# EAGLE design LampenSteuerung (EAGLE 7.0.0)
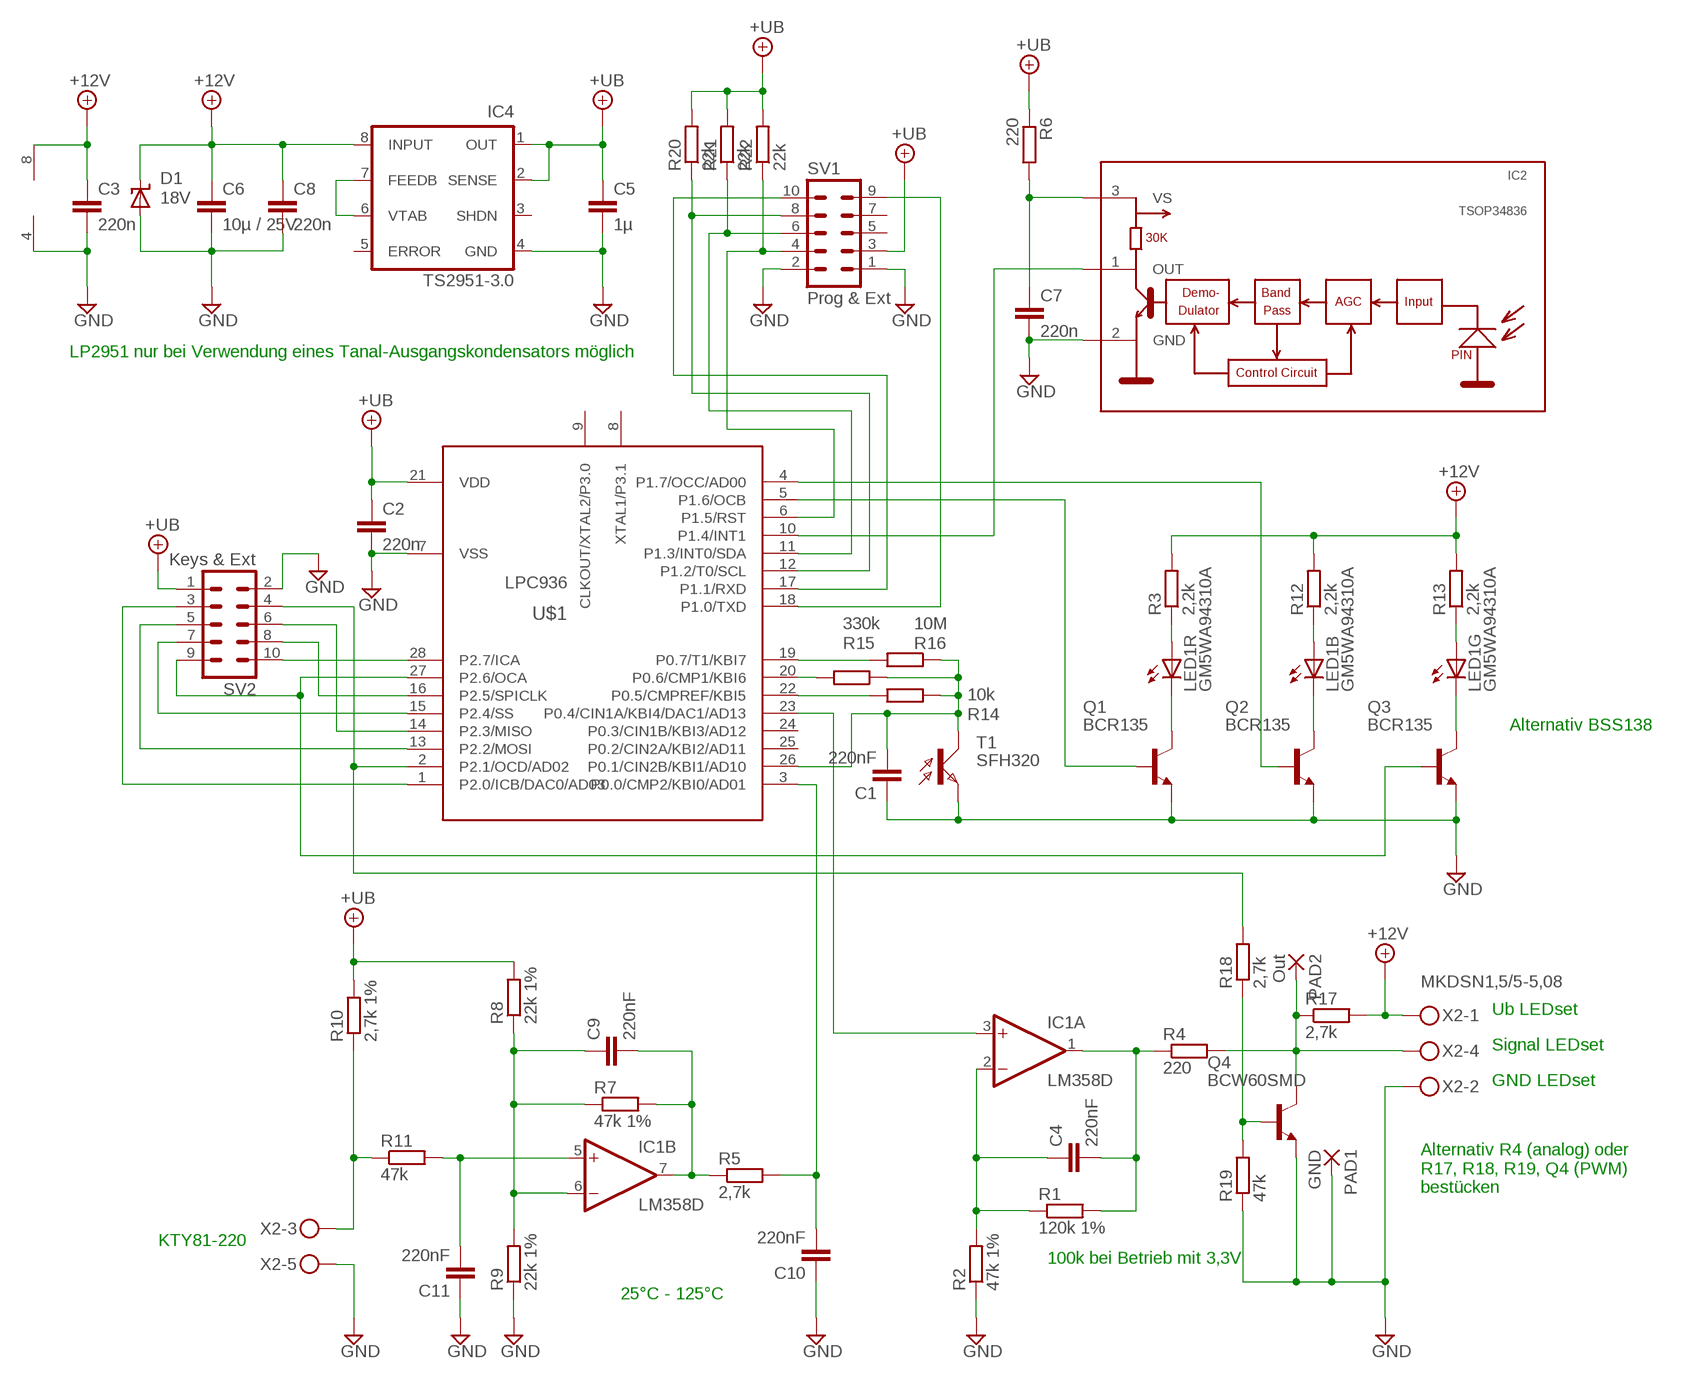
[diagram p0: schematic, sheet 1]

## Parts
C1  220nF  C-EUC0603  [C0603]
C2  220n  C-EUC0603  [C0603]
C3  220n  C-EUC0603  [C0603]
C4  220nF  C-EUC0603  [C0603]
C5  1µ  C-EUC0805  [C0805]
C6  10µ / 25V  C-EUC1206  [C1206]
C7  220n  C-EUC0603  [C0603]
C8  220n  C-EUC0603  [C0603]
C9  220nF  C-EUC0603  [C0603]
C10  220nF  C-EUC0603  [C0603]
C11  220nF  C-EUC0603  [C0603]
D1  18V  SUPPRESSOR-SMBJ  [SMBJ]
IC1  LM358D  [SO08]
IC2  TSOP34836  [TSOP348]
IC4  TS2951-3.0  LP2951CM-3.0  [SO-08]
LED1  GM5WA94310A  [GM5WA94310A]
PAD1  GND  1,6/0,8  [1,6/0,8]
PAD2  Out  1,6/0,8  [1,6/0,8]
Q1  BCR135  BCW60SMD  [SOT23-BEC]
Q2  BCR135  BCW60SMD  [SOT23-BEC]
Q3  BCR135  BCW60SMD  [SOT23-BEC]
Q4  BCW60SMD  [SOT23-BEC]
R1  120k 1%  R-EU_R0805  [R0805]
R2  47k 1%  R-EU_R0805  [R0805]
R3  2,2k  R-EU_R0805  [R0805]
R4  220  R-EU_R0805  [R0805]
R5  2,7k  R-EU_R0805  [R0805]
R6  220  R-EU_R0805  [R0805]
R7  47k 1%  R-EU_R0805  [R0805]
R8  22k 1%  R-EU_R0805  [R0805]
R9  22k 1%  R-EU_R0805  [R0805]
R10  2,7k 1%  R-EU_R0805  [R0805]
R11  47k  R-EU_R0805  [R0805]
R12  2,2k  R-EU_R0805  [R0805]
R13  2,2k  R-EU_R0805  [R0805]
R14  10k  R-EU_R0805  [R0805]
R15  330k  R-EU_R0805  [R0805]
R16  10M  R-EU_R0805  [R0805]
R17  2,7k  R-EU_R0805  [R0805]
R18  2,7k  R-EU_R0805  [R0805]
R19  47k  R-EU_R0805  [R0805]
R20  22k  R-EU_R0805  [R0805]
R21  22k  R-EU_R0805  [R0805]
R22  22k  R-EU_R0805  [R0805]
SV1  Prog & Ext  MA05-2  [MA05-2]
SV2  Keys & Ext  MA05-2  [MA05-2]
T1  SFH320  [PLCC2]
U$1  LPC936  [TSSOP28]
X2  MKDSN1,5/5-5,08  [MKDSN1,5/5-5,08]

## Nets
+12V: C3.1 C6.1 C8.1 D1.C IC1.8(P:V+) IC4.8(INPUT) R3.2 R12.2 R13.2 R17.2 X2.1
+UB: C2.1 C5.1 IC4.1(OUT) IC4.2(SENSE) R6.1 R8.2 R10.2 R20.2 R21.2 R22.2 SV1.3 SV2.1 U$1.21(VDD)
GND: C1.1 C2.2 C3.2 C5.2 C6.2 C7.2 C8.2 C10.1 C11.1 D1.A IC1.4(P:V-) IC2.2(GND) IC4.4(GND) PAD1.1(P) Q1.E Q2.E Q3.E Q4.E R2.1 R9.1 R19.1 SV1.1 SV1.2 SV2.2 T1.C(E) U$1.7(VSS) X2.2 X2.5
N$1: IC4.6(VTAB) IC4.7(FEEDB)
N$2: IC2.1(OUT) U$1.10(P1.4/INT1)
N$3: IC1.3(A:+IN) U$1.23(P0.4/CIN1A/KBI4/DAC1/AD13)
N$4: C9.1 IC1.6(B:-IN) R7.1 R8.1 R9.2
N$5: LED1.5(R:C) Q1.C
N$6: C4.2 IC1.1(A:OUT) R1.2 R4.1
N$7: C4.1 IC1.2(A:-IN) R1.1 R2.2
N$8: SV1.10 U$1.17(P1.1/RXD)
N$9: PAD2.1(P) Q4.C R4.2 R17.1 X2.4
N$10: C7.1 IC2.3(VS) R6.2
N$11: SV1.9 U$1.18(P1.0/TXD)
N$12: LED1.6(B:C) Q2.C
N$13: R22.1 SV1.4 U$1.6(P1.5/RST)
N$14: LED1.1(B:A) R12.1
N$15: R20.1 SV1.8 U$1.12(P1.2/T0/SCL)
N$16: R21.1 SV1.6 U$1.11(P1.3/INT0/SDA)
N$17: C10.2 R5.2 U$1.3(P0.0/CMP2/KBI0/AD01)
N$18: R10.1 R11.1 X2.3
N$19: C9.2 IC1.7(B:OUT) R5.1 R7.2
N$20: C11.2 IC1.5(B:+IN) R11.2
N$22: LED1.2(R:A) R3.1
N$23: SV2.3 U$1.1(P2.0/ICB/DAC0/AD03)
N$24: R18.2 SV2.4 U$1.2(P2.1/OCD/AD02)
N$25: SV2.5 U$1.13(P2.2/MOSI)
N$26: SV2.6 U$1.14(P2.3/MISO)
N$27: SV2.7 U$1.15(P2.4/SS)
N$28: SV2.8 U$1.16(P2.5/SPICLK)
N$29: Q3.B SV2.9 U$1.27(P2.6/OCA)
N$30: SV2.10 U$1.28(P2.7/ICA)
N$31: LED1.3(G:A) R13.1
N$32: LED1.4(G:C) Q3.C
N$33: Q1.B U$1.5(P1.6/OCB)
N$34: Q2.B U$1.4(P1.7/OCC/AD00)
N$36: C1.2 R14.1 R15.1 R16.1 T1.A(C) U$1.26(P0.1/CIN2B/KBI1/AD10)
N$37: R16.2 U$1.19(P0.7/T1/KBI7)
N$38: R15.2 U$1.20(P0.6/CMP1/KBI6)
N$39: R14.2 U$1.22(P0.5/CMPREF/KBI5)
N$40: Q4.B R18.1 R19.2
Unconnected: IC4.3(SHDN) IC4.5(ERROR) SV1.5 SV1.7 U$1.8(XTAL1/P3.1) U$1.9(CLKOUT/XTAL2/P3.0) U$1.24(P0.3/CIN1B/KBI3/AD12) U$1.25(P0.2/CIN2A/KBI2/AD11)

## Notes on the sheet
- LP2951 nur bei Verwendung eines Tanal-Ausgangskondensators möglich
- Alternativ BSS138
- Ub LEDset
- Signal LEDset
- GND LEDset
- Alternativ R4 (analog) oder
  R17, R18, R19, Q4 (PWM)
  bestücken
- KTY81-220
- 100k bei Betrieb mit 3,3V
- 25°C - 125°C

## Library data of the parts
C1-C11 = rcl:C-EU: CAPACITOR, European symbol
D1 = diode:SUPPRESSOR-: Suppressor diode
IC1 = linear:LM358: OP AMP also LM158; LM258; LM2904 Source: http://cache.national.com/ds/LM/LM158.pdf
IC2 = vishay-1:TSOP348*: IR Receiver Modules for Remote Control Systems http://www.vishay.com/ir-receiver-modules/
IC4 = v-reg:LP2951?*: Series of Adjustable Micropower Voltage Regulators Source: http://cache.national.com/ds/LP/LP2950.pdf
LED1 = led:GM5WA94310A: Chip LED RGB Source: http://document.sharpsma.com/files/GM5WA94310A_SS.pdf
PAD1 PAD2 = wirepad:1,6/0,8: THROUGH-HOLE PAD
Q1-Q4 = transistor-npn:BCW60*: NPN Transistor
R1-R22 = rcl:R-EU_: RESISTOR, European symbol
SV1 SV2 = con-lstb:MA05-2: PIN HEADER; OC_FARNELL: unknown; OC_NEWARK: unknown
T1 = opto2:SFH320: PHOTO TRANSISTOR
U$1 = nxp:LPC936
X2 = con-phoenix-508:MKDSN1,5/5-5,08: MKDSN 1,5/ 5-5,08 Printklemme Nennstrom: 13,5 A Nennspannung: 250 V Rastermaß: 5,08 mm Polzahl: 5 Anschlussart: Schraubanschluss Montage: Löten Anschlussrichtung Leiter/Platine: 0 ° Artikelnummer: 1729157 Source: http://eshop.phoenixcontact.com .. 1729157.pdf; MPN: SMKDSN1,5/5-5,08; OC_FARNELL: 1792906; OC_NEWARK: 70R0301

## Board
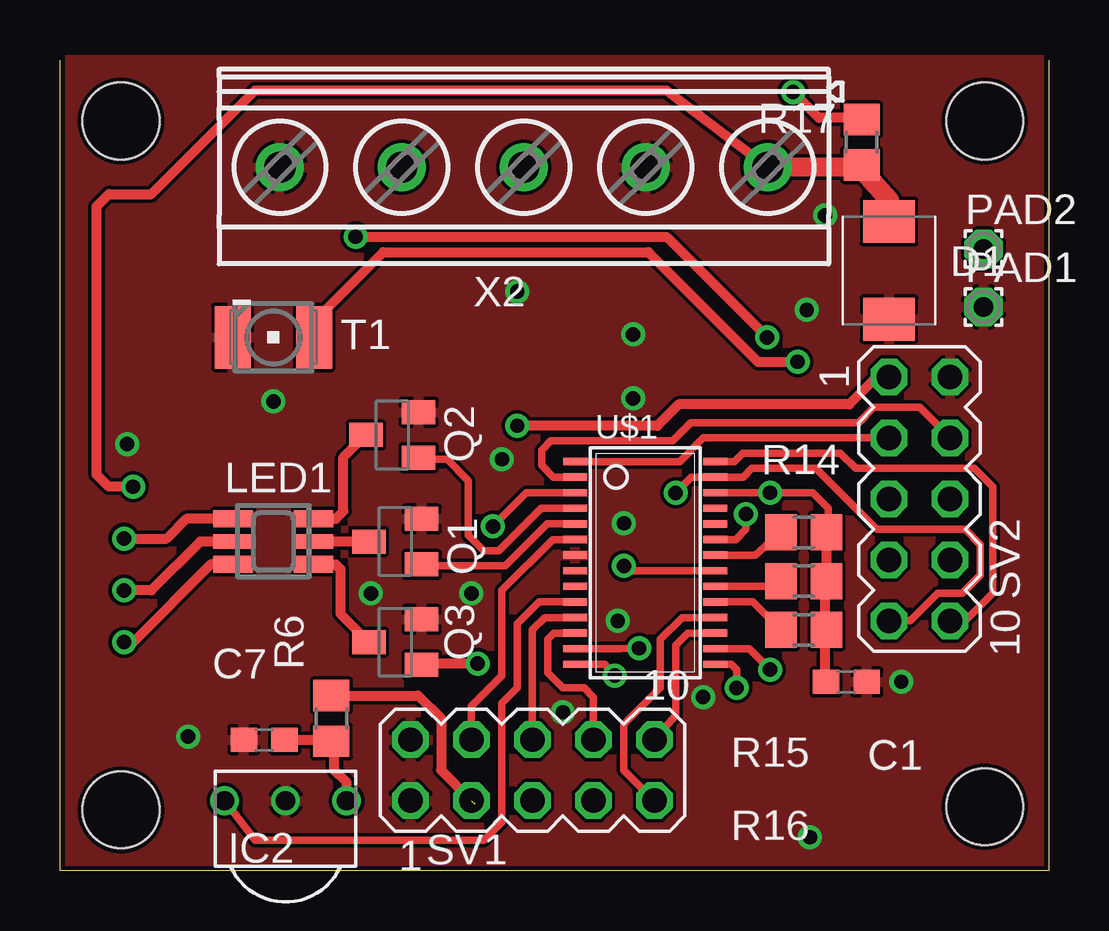
[diagram p1: board, top side]
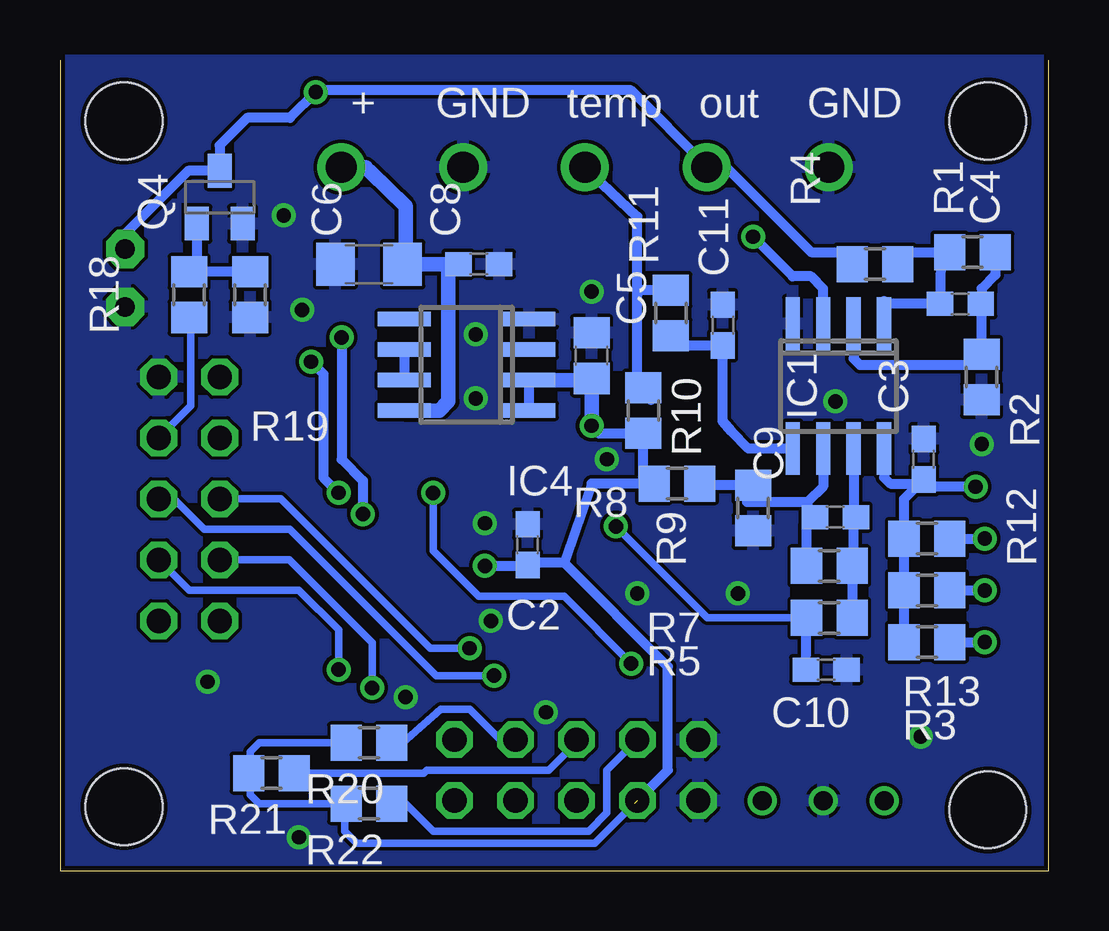
[diagram p2: board, bottom side, seen from below]

Size 41.2 x 33.78 mm. Coordinates in mm from the lower left corner, seen from the top.
Outline: 0,33.78 0,0 41.2,0 41.2,33.78
Copper layers (1*16): Top 0.035mm / dielectric 1.5mm / Bottom 0.035mm
Design rules "platinensammler_02": minimum track width 0.15mm, minimum drill 0.3mm, track to track 0.15mm, track to pad 0.15mm, pad to pad 0.15mm, via to via 0.15mm, smd to smd 0mil, copper to edge 0.2mm, drill to drill 0.2mm, minimum pad ring 0.2mm, minimum via ring 0.2mm, stop-mask expansion 4mil, vias tented up to drill 0.8mm, thermal gap 0.15mm
Holes 3.2 mm at 38.53,2.67 2.54,2.54 2.54,31.24 38.53,31.24

### Footprints (pad centres in the part's own frame; a part is rotated, then mirrored left to right if it is on the bottom)
C0603 = smd 1.1 x 1: 1 -0.85,0; 2 0.85,0
C0805 = smd 1.3 x 1.5: 1 -0.95,0; 2 0.95,0
C1206 = smd 1.6 x 1.8: 1 -1.4,0; 2 1.4,0
SMBJ = smd 1.78 x 2.16: A 2.04,0; C -2.03,0
SO08 = smd 0.6 x 2.2: 1 -1.905,-2.6; 2 -0.635,-2.6; 3 0.635,-2.6; 4 1.905,-2.6; 5 1.905,2.6; 6 0.635,2.6; 7 -0.635,2.6; 8 -1.905,2.6
TSOP348 = drill 0.8: 1 -2.54,0; 2 0,0; 3 2.54,0
SO-08 = smd 0.6 x 2.2: 1 -1.905,-2.6; 2 -0.635,-2.6; 3 0.635,-2.6; 4 1.905,-2.6; 5 1.905,2.6; 6 0.635,2.6; 7 -0.635,2.6; 8 -1.905,2.6
GM5WA94310A = smd 0.7 x 1.65: 1 -0.95,-1.675; 3 0.95,-1.675; 4 0.95,1.675; 6 -0.95,1.675 | smd 0.6 x 1.65: 2 0,-1.675; 5 0,1.675
1,6/0,8 = drill 0.813 pad 1.6 octagon: 1 0,0
SOT23-BEC = smd 1 x 1.4: B -0.95,-1.1; C 0,1.1; E 0.95,-1.1
R0805 = smd 1.3 x 1.5: 1 -0.95,0; 2 0.95,0
MA05-2 = drill 1.016 octagon: 1 -5.08,-1.27; 2 -5.08,1.27; 3 -2.54,-1.27; 4 -2.54,1.27; 5 0,-1.27; 6 0,1.27; 7 2.54,-1.27; 8 2.54,1.27; 9 5.08,-1.27; 10 5.08,1.27
PLCC2 = smd 2.6 x 1.5: A 0,1.7; C 0,-1.7
TSSOP28 = smd 0.305 x 0.991: 1 -4.225,-2.918; 2 -3.575,-2.918; 3 -2.925,-2.918; 4 -2.275,-2.918; 5 -1.625,-2.918; 6 -0.975,-2.918; 7 -0.325,-2.918; 8 0.325,-2.918; 9 0.975,-2.918; 10 1.625,-2.918; 11 2.275,-2.918; 12 2.925,-2.918; 13 3.575,-2.918; 14 4.225,-2.918; 15 4.225,2.918; 16 3.575,2.918; 17 2.925,2.918; 18 2.275,2.918; 19 1.625,2.918; 20 0.975,2.918; 21 0.325,2.918; 22 -0.325,2.918; 23 -0.975,2.918; 24 -1.625,2.918; 25 -2.275,2.918; 26 -2.925,2.918; 27 -3.575,2.918; 28 -4.225,2.918
MKDSN1,5/5-5,08 = drill 1.3 pad 2: 1 -10.181,0.025; 2 -5.101,0.025; 3 -0.021,0.025; 4 5.059,0.025; 5 10.139,0.025

### Placement (x,y rotation side)
C1  32.77,7.87 180 top
C2  21.72,13.59 90 bottom
C3  5.21,17.14 90 bottom
C4  3.68,23.62 180 bottom
C5  19.05,21.46 90 bottom
C6  28.32,25.27 180 bottom
C7  8.51,5.46 180 top
C8  23.75,25.27 0 bottom
C9  8.89,14.73 0 bottom
C10  9.27,8.38 180 bottom
C11  13.59,22.73 270 bottom
D1  34.54,25.02 270 top
IC1  8.76,20.19 180 bottom
IC2  9.4,2.92 0 top
IC4  24.26,21.08 90 bottom
LED1  8.89,13.72 270 top
PAD1  38.48,23.5 0 top
PAD2  38.48,25.91 0 top
Q1  13.97,13.72 90 top
Q2  13.84,18.16 90 top
Q3  13.97,9.53 90 top
Q4  34.54,28.07 0 bottom
R1  3.17,25.78 180 bottom
R2  2.79,20.57 90 bottom
R3  5.08,11.68 180 bottom
R4  7.24,25.27 180 bottom
R5  9.14,10.54 180 bottom
R6  11.3,6.35 270 top
R7  9.14,12.7 0 bottom
R8  15.49,16.13 180 bottom
R9  12.32,15.11 90 bottom
R10  16.89,19.18 270 bottom
R11  15.75,23.24 270 bottom
R12  5.08,13.84 180 bottom
R13  5.08,9.53 180 bottom
R14  30.99,14.1 180 top
R15  30.99,12.06 180 top
R16  30.99,10.03 180 top
R17  33.4,30.35 270 top
R18  35.81,24 270 bottom
R19  33.27,24 90 bottom
R20  28.32,5.33 180 bottom
R21  32.38,4.06 180 bottom
R22  28.32,2.79 180 bottom
SV1  19.68,4.19 0 top
SV2  35.81,15.49 270 top
T1  8.89,22.23 270 top
U$1  24.38,12.83 270 top
X2  19.3,29.34 180 top

### Tracks (layer width: path | path; a pad name or v marks a point on that pad's centre or on a via)
+12V  (via drill 0.6)
  Top 0.406: v3.05,16 2.03,16 1.52,16.51 1.52,27.69 2.03,28.19 3.81,28.19 8.13,32.51 25.27,32.51 X2.1 | R17.2 33.4,29.44 33.3,29.34
  Top 0.813: D1.C 34.54,27.94 33.3,29.34 X2.1
  Bottom 0.305: 28.47,29.31 28.28,29.12
  Bottom 0.406: IC1.8 6.86,16.38 6.6,16.13 4.95,16.13 C3.1 | C8.1 25.02,25.27 | C6.1 26.8,25.27 | R13.2 R3.2 R12.2 6.03,15.5 C3.1 | v3.05,16 4.76,16 C3.1
  Bottom 0.61: IC4.8 25.4,19.18 25.02,19.56 25.02,25.27 C6.1 | 26.8,25.27 26.8,27.69 28.28,29.12 28.37,29.21 | 28.47,29.31 X2.1
+UB  (via drill 0.6)  (1 unrouted)
  Top 0.305: U$1.21 23.69,12.5 v23.5,12.7
  Top 0.406: SV2.1 34.04,20.57 32.89,19.43 25.78,19.43 24.89,18.54 v19.05,18.54 | R6.1 14.93,7.3 15.88,6.35 15.88,4.19 SV1.3
  Bottom 0.305: 21.78,12.7 C2.1 | R20.2 32.89,5.33 33.27,4.95 33.27,4.12 R21.2 33.27,4 33.27,3.17 32.89,2.79 29.34,2.79 | R22.2 29.34,2.79 | 17.27,2.79 18.92,1.14 28.83,1.14 29.34,1.65 29.34,2.79
  Bottom 0.406: IC4.1 IC4.2 | 19.5,20.45 C5.1 | SV1.3 15.88,4.19 15.88,8.51 20.19,12.83 | v23.5,12.7 21.78,12.7 | 20.19,12.83 19.05,16.13 16.89,16.13 | 20.19,12.83 21.66,12.83 C2.1 | R8.2 16.76,15.75 16.89,16.13 | v19.05,18.54 18.73,18.23 R10.2 16.89,16.13
  Bottom 0.61: IC4.2 19.5,20.45 | v19.05,18.54 C5.1
GND  (via drill 0.6)
  other vias: 23.5,14.48 8.89,19.56 19.05,24.13 31.88,27.3 23.88,22.35 23.88,19.68 2.79,17.78 12.95,11.56 35.05,7.87 23.24,10.41 17.14,11.56 31.11,23.37 5.33,5.59 18.41,17.14 31.24,1.4 20.95,6.6 26.8,7.24
  pour Bottom: 41.2,33.78 0,33.78 0,0 41.2,0
  pour Top: 41.2,33.78 0,33.78 0,-0.13 41.2,0
N$1
  Bottom 0.406: IC4.6 IC4.7
N$2
  Top 0.305: U$1.10 19.96,11.2 19.05,10.29 19.05,7.62 18.41,6.99 18.41,2.03 17.65,1.27 8.13,1.27 IC2.1
N$3  (via drill 0.6)
  Top 0.305: U$1.23 28.15,13.8 28.57,14.22 v28.57,14.86
  Top 0.406: v12.32,26.42 25.27,26.42 v29.46,22.23
  Bottom 0.406: IC1.3 9.4,24.26 9.91,24.77 10.67,24.77 v12.32,26.42 | v29.46,22.23 29.46,17.14 28.57,16.26 v28.57,14.86
N$4
  Bottom 0.305: 14.61,16.06 R8.1 | 12.57,15.37 R9.2
  Bottom 0.406: IC1.6 9.4,16 10.03,15.37 | 12.57,15.37 10.03,15.37 | R9.2 14.61,16.06 | R7.1 10.09,14.38 C9.1 9.99,14.82 10.03,15.37
N$5
  Top 0.406: Q1.C LED1.5
N$6
  Bottom 0.406: R4.1 6.29,25.71 6.22,25.78 R1.2 4.51,25.37 C4.2 6.86,23.62 | 6.86,23.75 6.86,23.62 | 6.86,23.62 IC1.1
N$7
  Bottom 0.406: R1.1 2.23,24.83 2.79,24.26 C4.1 2.79,23.81 R2.2 2.86,21.08 7.87,21.08 8.13,21.34 IC1.2
N$8
  Top 0.305: U$1.17 26.17,9.9 25.65,9.4 25.65,6.48 SV1.10
N$9  (via drill 0.6)
  Top 0.406: R17.1 33.21,31.3 33.15,31.37 31.62,31.37 v30.54,32.45
  Bottom 0.406: R4.2 8.19,25.71 8.26,25.78 9.91,25.78 13.36,29.23 14.16,29.23 X2.4 14.24,29.36 17.4,32.51 30.48,32.51 v30.54,32.45 31.62,31.37 33.4,31.37 34.54,30.23 Q4.C 35.86,29.17 38.48,26.54 PAD2.1
N$10
  Top 0.406: IC2.3 11.94,3.68 11.43,4.19 11.43,5.27 R6.2 11.24,5.46 C7.1
N$11
  Top 0.305: SV1.9 23.5,4.19 23.5,6.1 25.02,7.62 25.02,9.65 25.92,10.55 U$1.18
N$12
  Top 0.406: LED1.6 11.49,14.67 11.81,14.99 11.81,17.23 Q2.C
N$13
  Top 0.305: U$1.6 20.53,13.8 18.41,11.68 18.41,8.13 17.14,6.86 SV1.4
  Bottom 0.305: R22.1 26.8,2.79 25.65,1.65 19.18,1.65 18.41,2.41 18.41,4.19 SV1.4
N$14  (via drill 0.6)
  Top 0.406: LED1.1 5.27,14.67 4.45,13.84 v2.67,13.84
  Bottom 0.406: R12.1 v2.67,13.84
N$15
  Top 0.305: U$1.12 20.57,9.9 20.32,9.65 20.32,8.26 20.95,7.62 21.84,7.62 22.23,7.24 SV1.8
  Bottom 0.305: SV1.8 22.86,5.46 24.13,6.73 25.34,6.73 26.92,5.33 R20.1
N$16
  Top 0.305: U$1.11 20.2,10.55 19.68,10.03 SV1.6
  Bottom 0.305: SV1.6 19.68,5.33 20.83,4.19 25.91,4.19 26.04,4.06 R21.1
N$17  (via drill 0.6)
  Top 0.305: v18.03,14.35 19.43,15.75 U$1.3
  Bottom 0.305: R5.2 14.22,10.54 v18.03,14.35
  Bottom 0.406: C10.2 R5.2
N$18
  Bottom 0.406: X2.3 17.14,27.26 17.14,24 | R10.1 16.57,19.62 17.14,20.19 17.14,24 | R11.1 17.08,24.19 17.14,24
N$19
  Bottom 0.406: IC1.7 8.13,14.42 | 8.13,14.42 C9.2 | R5.1 R7.2 8.13,12.7 8.13,14.42
N$20
  Bottom 0.406: IC1.5 12.51,17.59 13.21,18.29 13.59,18.73 C11.2 15.34,21.88 R11.2
N$22  (via drill 0.6)
  Top 0.406: LED1.2 5.84,13.72 3.81,11.68 v2.67,11.68
  Bottom 0.406: R3.1 v2.67,11.68
N$23
  Top 0.305: U$1.1 25.82,17.05 26.8,18.03 SV2.3
N$24
  Top 0.305: U$1.2 20.55,16.4 20.07,16.89 20.07,17.53 20.45,17.91 25.53,17.91 26.29,18.67 33.27,18.67 33.91,19.3 35.81,19.3 SV2.4
  Bottom 0.305: SV2.4 35.75,19.37 35.75,22.99 R18.2
N$25  (via drill 0.6)
  Top 0.305: U$1.13 23.35,9.25 v24.13,9.27
  Bottom 0.305: v24.13,9.27 25.78,9.27 32,15.49 SV2.5
N$26  (via drill 0.6)
  Top 0.305: U$1.14 22.7,8.6 v23.11,8.13
  Bottom 0.305: v23.11,8.13 25.53,8.13 31.62,14.22 35.18,14.22 36.45,15.49 SV2.6
N$27  (via drill 0.6)
  Top 0.305: U$1.15 27.97,8.6 28.19,8.38 v28.19,7.62
  Bottom 0.305: v28.19,7.62 28.19,7.75 28.19,9.49 31.65,12.95 SV2.7
N$28  (via drill 0.6)
  Top 0.305: U$1.16 28.72,9.25 v29.59,8.38
  Bottom 0.305: v29.59,8.38 29.59,10.03 31.24,11.68 35.81,11.68 SV2.8
N$29  (via drill 0.6)
  Top 0.305: v25.65,15.75 26.31,16.4 U$1.27 28.47,16.4 28.83,16.76 31.5,16.76 34.04,14.22 37.72,14.22 38.35,13.59 38.35,12.32 37.59,11.56 36.58,11.56 35.43,10.41 SV2.9 | 15.13,8.64 Q3.B
  Top 0.406: v17.4,8.64 15.13,8.64
  Bottom 0.305: v25.65,15.75 25.65,13.34 23.75,11.43 20.19,11.43 v17.4,8.64
N$30
  Top 0.305: SV2.10 37.72,10.41 38.86,11.56 38.86,16 38.1,16.76 33.15,16.76 32.51,17.4 28.45,17.4 28.1,17.05 U$1.28
N$31  (via drill 0.6)
  Top 0.406: v2.67,9.53 3.05,9.53 6.29,12.77 LED1.3
  Bottom 0.406: R13.1 v2.67,9.53
N$32
  Top 0.406: LED1.4 11.49,12.77 11.68,12.57 11.68,10.71 Q3.C
N$33
  Top 0.305: U$1.5 20.29,14.45 18.54,12.7 15.01,12.7 Q1.B
N$34
  Top 0.305: U$1.4 20.05,15.1 18.29,13.34 17.65,13.34 17.02,13.97 17.02,16.26 16.13,17.14 15.01,17.14 Q2.B
N$36  (via drill 0.6)
  Top 0.305: U$1.26 v29.59,15.75 30.73,15.75 31.37,15.75 32,15.11 32,14.48 31.94,14.41 R14.1 | C1.2 31.88,7.87 31.88,8.13
  Top 0.406: 31.88,8.13 31.88,10.35 | 31.88,10.35 R16.1 | v30.73,21.21 29.08,21.21 24.51,25.78 13.46,25.78 10.67,22.99 10.67,22.3 T1.A | 31.88,10.35 31.88,12 R15.1 R14.1
  Bottom 0.305: v29.59,15.75
  Bottom 0.406: v30.73,21.21 30.23,20.7 30.23,16.38 v29.59,15.75
N$37
  Top 0.305: U$1.19 28.87,11.2 R16.2
N$38
  Top 0.305: U$1.20 29.82,11.85 R15.2
N$39
  Top 0.305: U$1.22 28.97,13.15 R14.2
N$40
  Bottom 0.406: R19.2 35.56,24.95 | 35.56,24.95 R18.1 | Q4.B 35.49,25.02 35.56,24.95

### Text on the board
bNames: + GND temp out GND